# EAGLE design phase-detector (EAGLE 5.06)
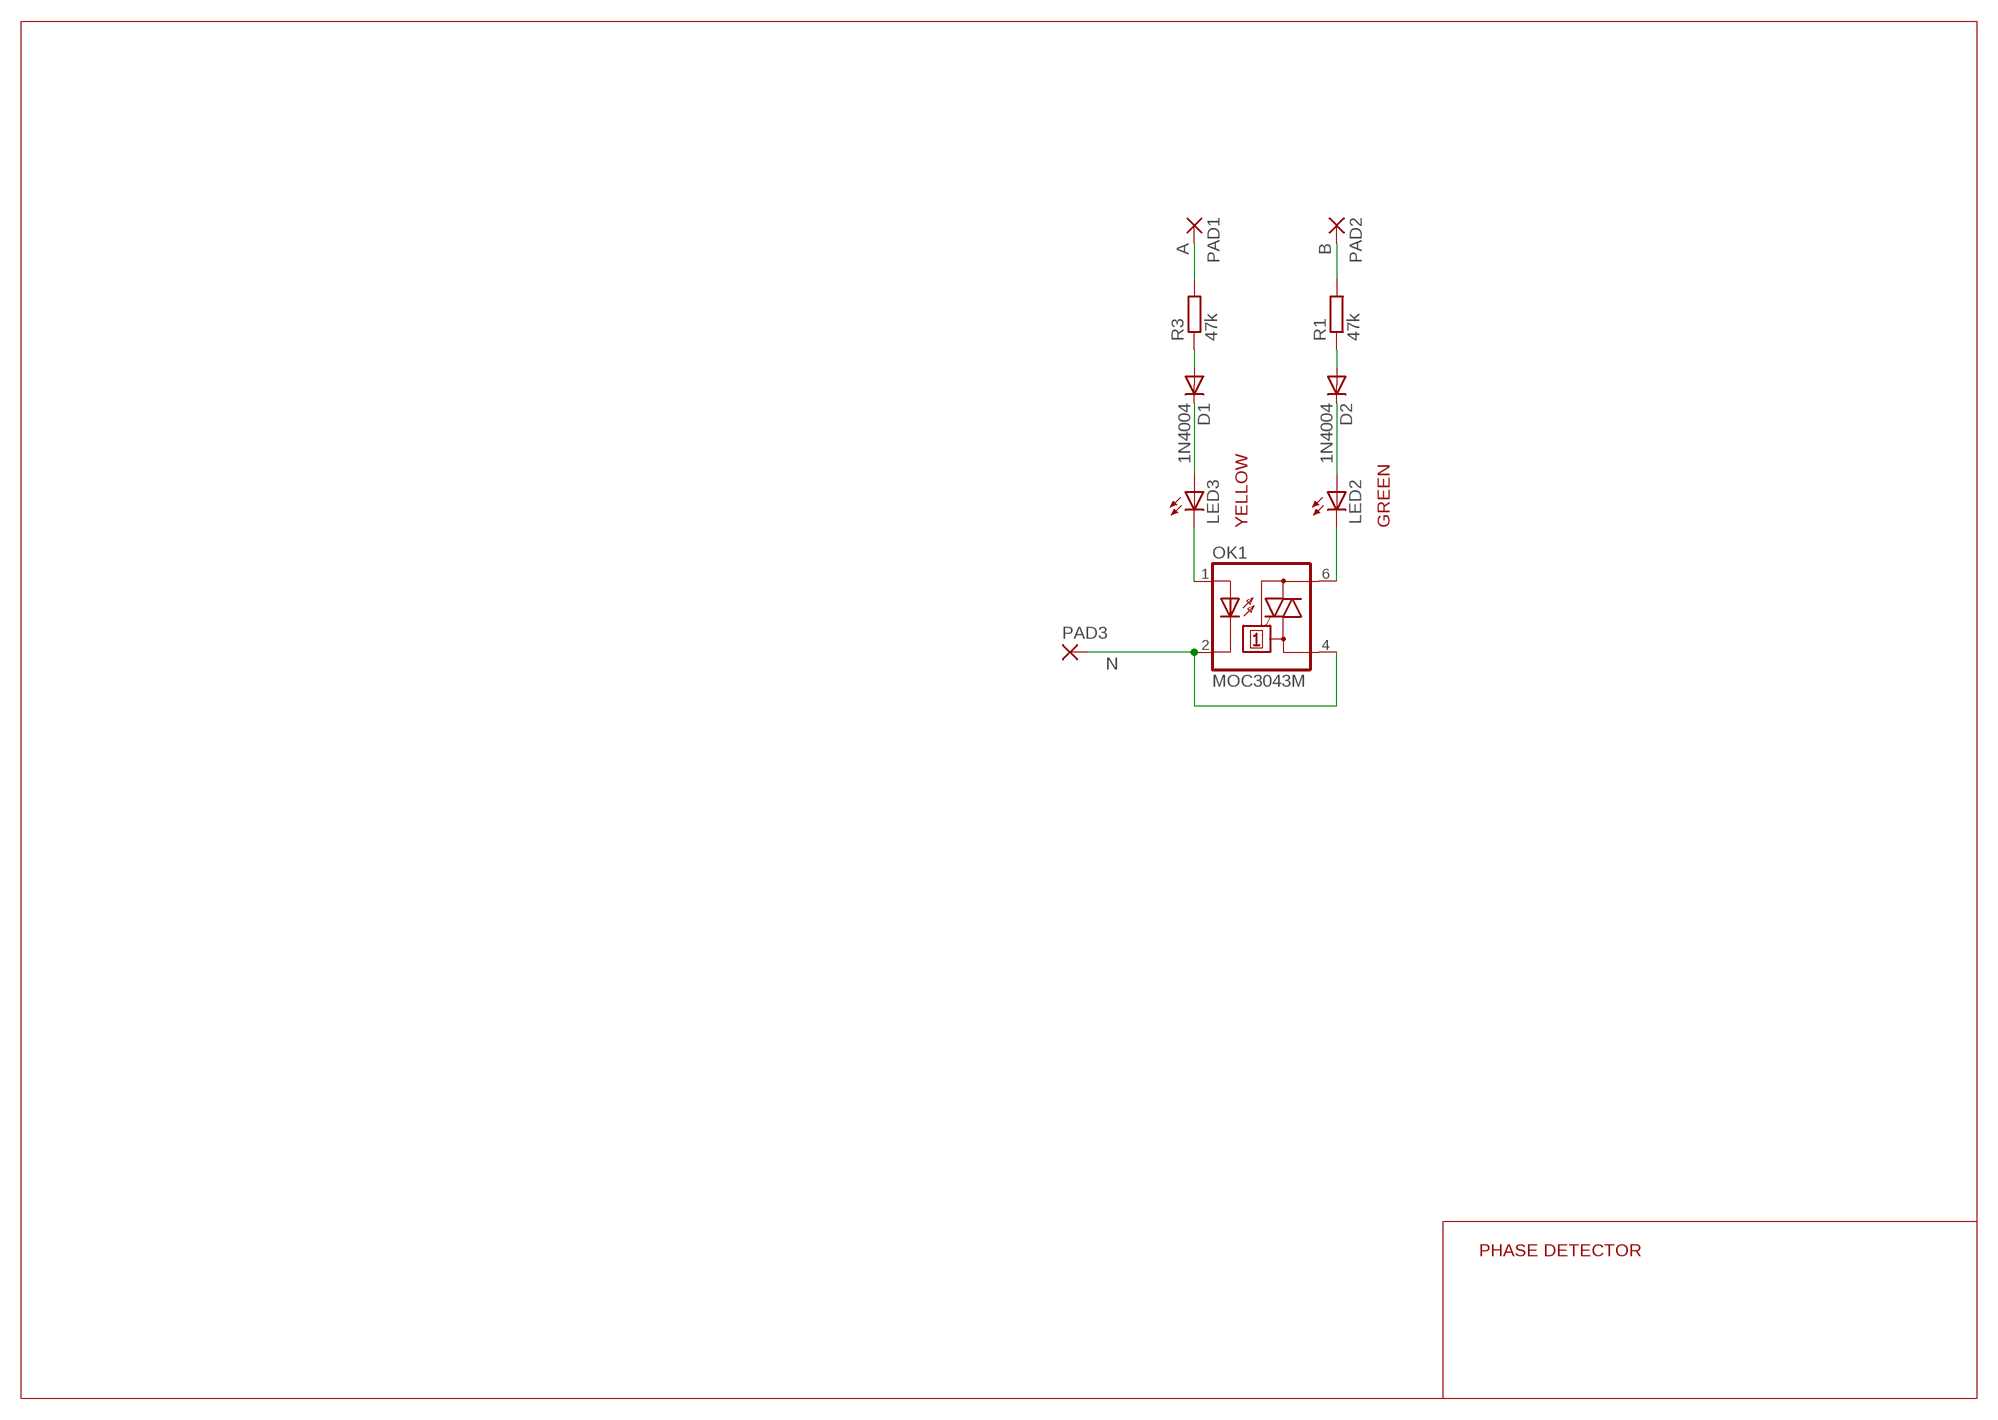
[diagram p0: schematic, sheet 1]

## Parts
D1  1N4004  [DO41-10]
D2  1N4004  [DO41-10]
LED2  LED3MM  [LED3MM]
LED3  LED3MM  [LED3MM]
OK1  MOC3043M  [DIL06]
PAD1  2,15/1,0  [2,15/1,0]
PAD2  2,15/1,0  [2,15/1,0]
PAD3  2,15/1,0  [2,15/1,0]
R1  47k  R-EU_0207/10  [0207/10]
R3  47k  R-EU_0207/10  [0207/10]

## Nets
A: PAD1.1(P) R3.2
B: PAD2.1(P) R1.2
N: OK1.2(C) OK1.4(A1) PAD3.1(P)
N$1: LED3.K(C) OK1.1(A)
N$2: LED2.K(C) OK1.6(A2)
N$3: D1.C LED3.A
N$4: D2.C LED2.A
N$5: D1.A R3.1
N$6: D2.A R1.1

## Notes on the sheet
- YELLOW | GREEN
- PHASE DETECTOR

## Library data of the parts
D1 D2 = diode:1N4004: DIODE general purpose rectifier, 1 A
LED2 LED3 = led:LED: LED OSRAM: - CHIPLED LG R971, LG N971, LY N971, LG Q971, LY Q971, LO R971, LY R971 LH N974, LH R974 LS Q976, LO Q976, LY Q976 LO Q996 - Hyper CHIPLED LW Q18S LB Q993, LB Q99A, LB R99A - SideLED LS A670, LO A670, LY A670, LG A670, LP A670 LB A673, LV A673, LT A673, LW A673 LH A674 LY A675 LS A676, LA A676, LO A676, LY A676, LW A676 LS A679, LY A679, LG A679 - Hyper Micro SIDELED® LS Y876, LA Y876, LO Y876, LY Y876 LT Y87S - SmartLED LW L88C, LW L88S LB L89C, LB L89S, LG L890 LS L89K, LO L89K, LY L89K LS L896, LA L896, LO L896, LY L896 - TOPLED LS T670, LO T670, LY T670, LG T670, LP T670 LSG T670, LSP T670, LSY T670, LOP T670, LYG T670 LG T671, LOG T671, LSG T671 LB T673, LV T673, LT T673, LW T673 LH T674 LS T676, LA T676, LO T676, LY T676, LB T676, LH T676, LSB T676, LW T676 LB T67C, LV T67C, LT T67C, LS T67K, LO T67K, LY T67K, LW E67C LS E67B, LA E67B, LO E67B, LY E67B, LB E67C, LV E67C, LT E67C LW T67C LS T679, LY T679, LG T679 LS T770, LO T770, LY T770, LG T770, LP T770 LB T773, LV T773, LT T773, LW T773 LH T774 LS E675, LA E675, LY E675, LS T675 LS T776, LA T776, LO T776, LY T776, LB T776 LHGB T686 LT T68C, LB T68C - Hyper Mini TOPLED® LB M676 - Mini TOPLED Santana® LG M470 LS M47K, LO M47K, LY M47K Source: http://www.osram.convergy.de LUXEON: - LUMILED® LXK2-PW12-R00, LXK2-PW12-S00, LXK2-PW14-U00, LXK2-PW14-V00 LXK2-PM12-R00, LXK2-PM12-S00, LXK2-PM14-U00 LXK2-PE12-Q00, LXK2-PE12-R00, LXK2-PE12-S00, LXK2-PE14-T00, LXK2-PE14-U00 LXK2-PB12-K00, LXK2-PB12-L00, LXK2-PB12-M00, LXK2-PB14-N00, LXK2-PB14-P00, LXK2-PB14-Q00 LXK2-PR12-L00, LXK2-PR12-M00, LXK2-PR14-Q00, LXK2-PR14-R00 LXK2-PD12-Q00, LXK2-PD12-R00, LXK2-PD12-S00 LXK2-PH12-R00, LXK2-PH12-S00 LXK2-PL12-P00, LXK2-PL12-Q00, LXK2-PL12-R00 Source: www.luxeon.com KINGBRIGHT: KA-3528ASYC Source: www.kingbright.com
OK1 = optocoupler:MOC30*: 6-Pin DIP Zero-Cross Optoisolators Triac Driver Output (250/400 Volt Peak) Source: http://www.fairchildsemi.com/ds/MO/MOC3043-M.pdf
PAD1-PAD3 = wirepad:2,15/1,0: THROUGH-HOLE PAD
R1 R3 = rcl:R-EU_: RESISTOR, European symbol

## Net classes
1 thin: width 0.254 mm
2 z: width 0.127 mm

## Board
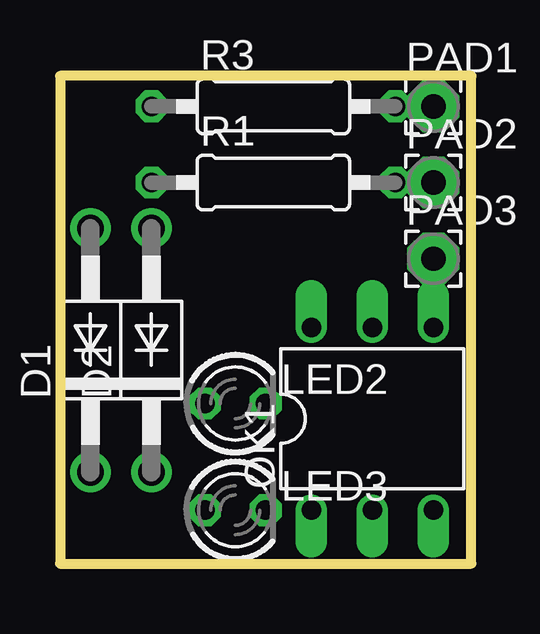
[diagram p1: board, top side]
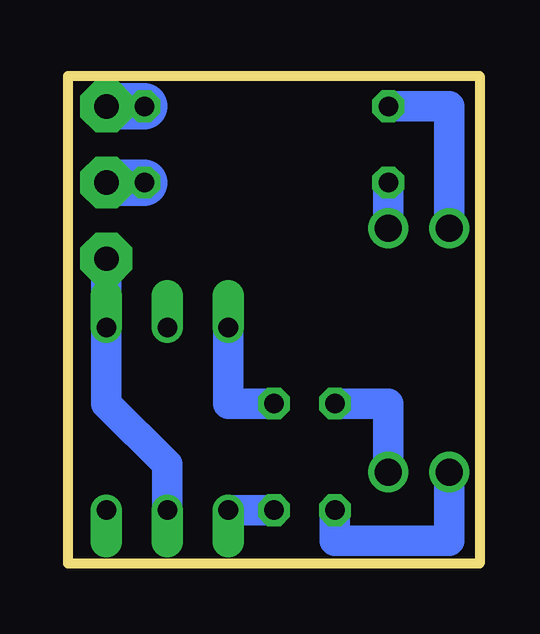
[diagram p2: board, bottom side, seen from below]

Size 17.14 x 20.32 mm. Coordinates in mm from the lower left corner, seen from the top.
Outline: 0,0 17.14,0 17.14,20.32 0,20.32 0,0
Copper layers (1*16): Top 0.035mm / dielectric 1.5mm / Bottom 0.035mm
Design rules "default": minimum track width 10mil, minimum drill 24mil, track to track 8mil, track to pad 8mil, pad to pad 8mil, via to via 8mil, smd to smd 8mil, copper to edge 40mil, drill to drill 8mil, minimum pad ring 10mil, minimum via ring 8mil, stop-mask expansion 4mil, vias tented up to drill 0mil, thermal gap 10mil

### Footprints (pad centres in the part's own frame; a part is rotated, then mirrored left to right if it is on the bottom)
DO41-10 = drill 1.118 round: A 5.08,0; C -5.08,0
LED3MM = drill 0.813 octagon: A -1.27,0; K 1.27,0
DIL06 = drill 0.813 offset: 1 -2.54,-3.81; 2 0,-3.81; 3 2.54,-3.81; 4 2.54,3.81; 5 0,3.81; 6 -2.54,3.81
2,15/1,0 = drill 1.016 pad 2.159 octagon: 1 0,0
0207/10 = drill 0.813 octagon: 1 -5.08,0; 2 5.08,0

### Placement (x,y rotation side)
D1  1.27,8.89 90 top
D2  3.81,8.89 90 top
LED2  7.3,6.67 0 top
LED3  7.3,2.22 0 top
OK1  13.02,6.03 0 top
PAD1  15.56,19.05 0 top
PAD2  15.56,15.88 0 top
PAD3  15.56,12.7 0 top
R1  8.89,15.88 0 top
R3  8.89,19.05 0 top

### Tracks (layer width: path | path; a pad name or v marks a point on that pad's centre or on a via)
A
  Bottom 1.93: PAD1.1 R3.2
B
  Bottom 1.93: PAD2.1 R1.2
N
  Bottom 1.27: OK1.2 13.02,4.13 15.56,6.67 OK1.4 PAD3.1
N$1
  Bottom 1.27: OK1.1 LED3.K
N$2
  Bottom 1.27: LED2.K 10.48,6.67 OK1.6
N$3
  Bottom 1.27: LED3.A 6.03,0.95 1.27,0.95 D1.C
N$4
  Bottom 1.27: LED2.A 3.81,6.67 D2.C
N$5
  Bottom 1.27: D1.A 1.27,19.05 R3.1
N$6
  Bottom 1.27: D2.A R1.1